# EAGLE schematic PlainPCB (EAGLE 9.6.2)
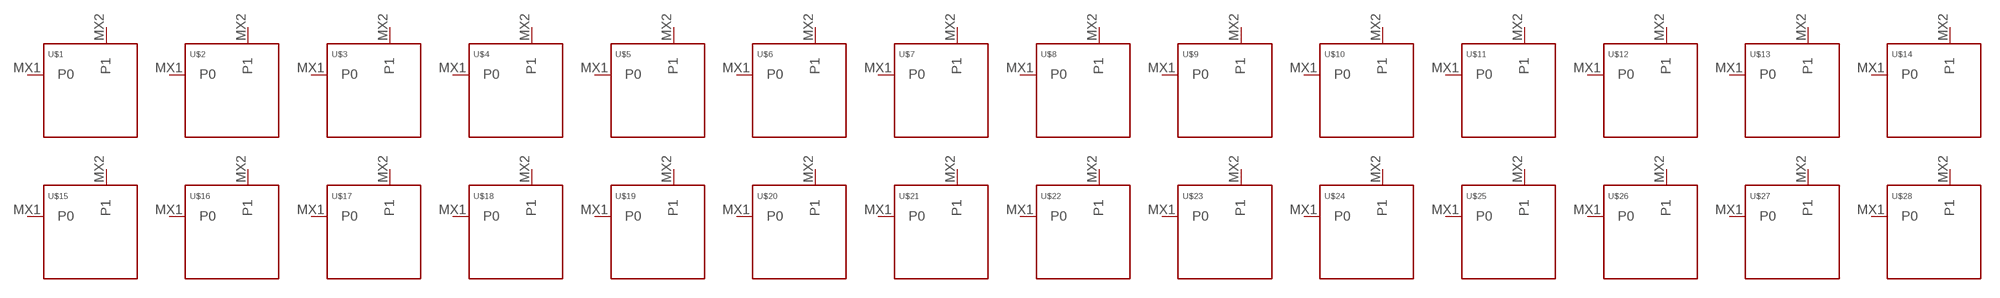
[diagram p0: schematic, sheet 1]

## Parts
U$1  KEYSWITCH-PLAIN-MX-1U  [MX-1U]
U$2  KEYSWITCH-PLAIN-MX-1U  [MX-1U]
U$3  KEYSWITCH-PLAIN-MX-1U  [MX-1U]
U$4  KEYSWITCH-PLAIN-MX-1U  [MX-1U]
U$5  KEYSWITCH-PLAIN-MX-1U  [MX-1U]
U$6  KEYSWITCH-PLAIN-MX-1U  [MX-1U]
U$7  KEYSWITCH-PLAIN-MX-1U  [MX-1U]
U$8  KEYSWITCH-PLAIN-MX-1U  [MX-1U]
U$9  KEYSWITCH-PLAIN-MX-1U  [MX-1U]
U$10  KEYSWITCH-PLAIN-MX-1U  [MX-1U]
U$11  KEYSWITCH-PLAIN-MX-1U  [MX-1U]
U$12  KEYSWITCH-PLAIN-MX-1U  [MX-1U]
U$13  KEYSWITCH-PLAIN-MX-1U  [MX-1U]
U$14  KEYSWITCH-PLAIN-MX-1U  [MX-1U]
U$15  KEYSWITCH-PLAIN-MX-1U  [MX-1U]
U$16  KEYSWITCH-PLAIN-MX-1U  [MX-1U]
U$17  KEYSWITCH-PLAIN-MX-1U  [MX-1U]
U$18  KEYSWITCH-PLAIN-MX-1U  [MX-1U]
U$19  KEYSWITCH-PLAIN-MX-1U  [MX-1U]
U$20  KEYSWITCH-PLAIN-MX-1U  [MX-1U]
U$21  KEYSWITCH-PLAIN-MX-1U  [MX-1U]
U$22  KEYSWITCH-PLAIN-MX-1U  [MX-1U]
U$23  KEYSWITCH-PLAIN-MX-1U  [MX-1U]
U$24  KEYSWITCH-PLAIN-MX-1U  [MX-1U]
U$25  KEYSWITCH-PLAIN-MX-1U  [MX-1U]
U$26  KEYSWITCH-PLAIN-MX-1U  [MX-1U]
U$27  KEYSWITCH-PLAIN-MX-1U  [MX-1U]
U$28  KEYSWITCH-PLAIN-MX-1U  [MX-1U]
Unconnected: U$1.MX1(P0) U$1.MX2(P1) U$2.MX1(P0) U$2.MX2(P1) U$3.MX1(P0) U$3.MX2(P1) U$4.MX1(P0) U$4.MX2(P1) U$5.MX1(P0) U$5.MX2(P1) U$6.MX1(P0) U$6.MX2(P1) U$7.MX1(P0) U$7.MX2(P1) U$8.MX1(P0) U$8.MX2(P1) U$9.MX1(P0) U$9.MX2(P1) U$10.MX1(P0) U$10.MX2(P1) U$11.MX1(P0) U$11.MX2(P1) U$12.MX1(P0) U$12.MX2(P1) U$13.MX1(P0) U$13.MX2(P1) U$14.MX1(P0) U$14.MX2(P1) U$15.MX1(P0) U$15.MX2(P1) U$16.MX1(P0) U$16.MX2(P1) U$17.MX1(P0) U$17.MX2(P1) U$18.MX1(P0) U$18.MX2(P1) U$19.MX1(P0) U$19.MX2(P1) U$20.MX1(P0) U$20.MX2(P1) U$21.MX1(P0) U$21.MX2(P1) U$22.MX1(P0) U$22.MX2(P1) U$23.MX1(P0) U$23.MX2(P1) U$24.MX1(P0) U$24.MX2(P1) U$25.MX1(P0) U$25.MX2(P1) U$26.MX1(P0) U$26.MX2(P1) U$27.MX1(P0) U$27.MX2(P1) U$28.MX1(P0) U$28.MX2(P1)

## Library data of the parts
U$1-U$28 = Keyboard:KEYSWITCH-PLAIN